# Altium project Summits7Beta.PrjPcb
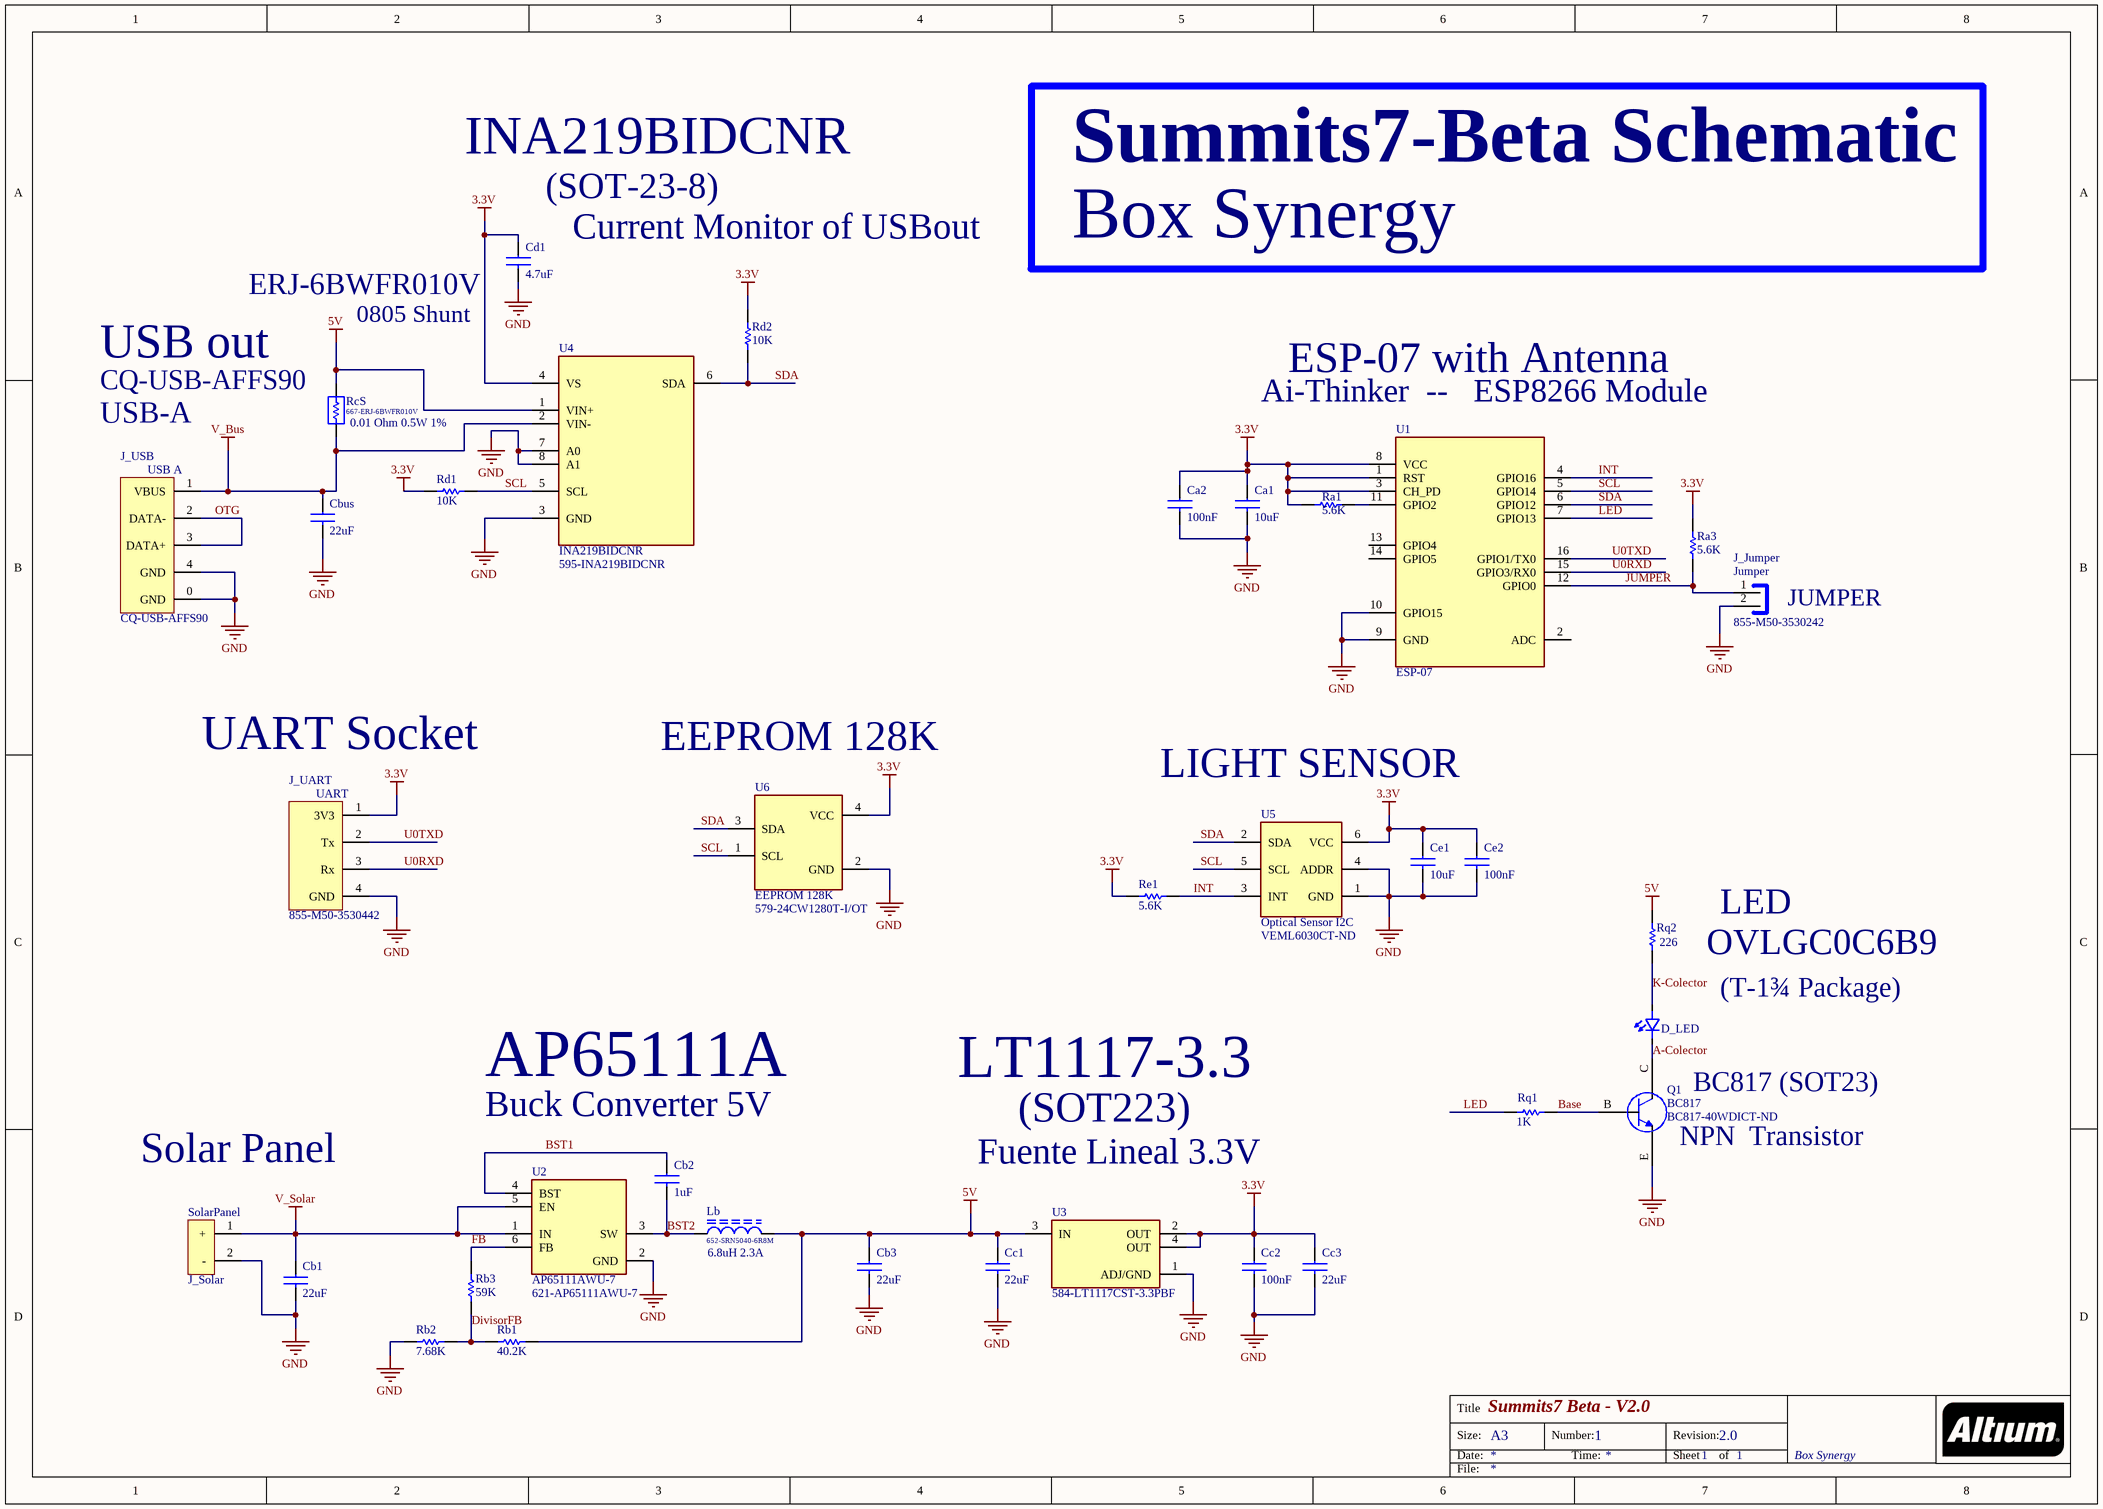
[diagram p0: Summits7Beta_Sch.SchDoc]
1 sheet, 36 parts. Net scope: global (net labels, ports and power ports of the same name join across sheets).
Board file: Summits7Beta_PCB2.PcbDoc

## Sheet Summits7Beta_Sch.SchDoc: Summits7 Beta - V2.0
size A3; Author: Gustavo Belbruno; CompanyName: Box Synergy; DrawnBy: Gustavo Belbruno; Engineer: Gustavo Belbruno; Address4: Box Synergy; DocumentNumber: 1; Revision: 2.0; SheetNumber: 1; SheetTotal: 1

### Parts
Ca1  10uF  [CAP_0603]
Ca2  100nF  [CAP_0603]
Cb1  22uF  [CAP_1210]
Cb2  1uF  [CAP_0603]
Cb3  22uF  [CAP_1210]
Cbus  22uF  [CAP_1210]
Cc1  22uF  [CAP_0603]
Cc2  100nF  [CAP_0603]
Cc3  22uF  [CAP_1210]
Cd1  4.7uF  [CAP_0603]
Ce1  10uF  [CAP_0603]
Ce2  100nF  [CAP_0603]
D_LED  OVLGC0C6B9  [LED]  (value not drawn)
J_Jumper  Supplier Part Number 1: 855-M50-3530242  [JUMPER-1.27 mm]  (hidden comment: M50-3530242)
J_Solar  Connx2_Panel  [PANEL_IN]  (value not drawn)
J_UART  Supplier Part Number 1: 855-M50-3530442  [UART-1.27mm]  (hidden comment: M50-3530442)
J_USB  CQ-USB-AFFS90  [USB-A__IPX8]
Lb  6.8uH 2.3A  Supplier Part Number 1: 652-SRN5040-6R8M  [Inductor_SRN5040]
Q1  BC817  Supplier Part Number 1: BC817-40WDICT-ND  [Transistor_SOT23-3]
Ra1  5.6K  [RES_0603]
Ra3  5.6K  [RES_0603]
Rb1  40.2K  [RES_0603]
Rb2  7.68K  [RES_0603]
Rb3  59K  [RES_0603]
RcS  0.01 Ohm 0.5W 1%  Supplier Part Number 1: 667-ERJ-6BWFR010V  [RES-SHUNT-0805]
Rd1  10K  [RES_0603]
Rd2  10K  [RES_0603]
Re1  5.6K  [RES_0603]
Rq1  1K  [RES_0603]
Rq2  226  [RES_0603]
U1  ESP-07  [ESP-07]
U2  AP65111AWU-7  Supplier Part Number 1: 621-AP65111AWU-7  [AP65111A-SOT23-6]
U3  Supplier Part Number 1: 584-LT1117CST-3.3PBF  [LT1117IST-3.3_SOT-223]  (hidden comment: LT1117IST-3.3)
U4  INA219BIDCNR  Supplier Part Number 1: 595-INA219BIDCNR  [INA219B SOT23]
U5  Optical Sensor I2C  Supplier Part Number 1: VEML6030CT-ND  [VEML6030]
U6  EEPROM 128K  Supplier Part Number 1: 579-24CW1280T-I/OT  [24CW128]

### Nets
3.3V: Ca1.1 Ca2.1 Cc2.1 Cc3.1 Cd1.1 Ce1.1 Ce2.1 J_UART.1(3V3) Ra1.2 Ra3.1 Rd1.1 Rd2.1 Re1.1 U1.1(RST) U1.3(CH_PD) U1.8(VCC) U3.2(OUT) U3.4(OUT) U4.4(VS) U5.6(VCC) U6.4(VCC)
5V: Cb3.1 Cc1.1 Lb.1 Rb1.1 RcS.1 Rq2.1 U3.3(IN) U4.1(VIN+)
GND: Ca1.2 Ca2.2 Cb1.2 Cb3.2 Cbus.2 Cc1.2 Cc2.2 Cc3.2 Cd1.2 Ce1.2 Ce2.2 J_Jumper.2 J_Solar.2(-) J_UART.4(GND) J_USB.0(GND) J_USB.4(GND) Q1.E Rb2.2 U1.9(GND) U1.10(GPIO15) U2.2(GND) U3.1(ADJ/GND) U4.3(GND) U4.7(A0) U4.8(A1) U5.1(GND) U5.4(ADDR) U6.2(GND)
V_Bus: Cbus.1 J_USB.1(VBUS) RcS.2 U4.2(VIN-)
V_Solar: Cb1.1 J_Solar.1(+) U2.1(IN) U2.5(EN)
A-Colector: D_LED.1(K) Q1.C
Base: Q1.B Rq1.1
BST1: Cb2.1 U2.4(BST)
BST2: Cb2.2 Lb.2 U2.3(SW)
DivisorFB: Rb1.2 Rb2.1 Rb3.2
FB: Rb3.1 U2.6(FB)
INT: Re1.2 U1.4(GPIO16) U5.3(INT)
JUMPER: J_Jumper.1 Ra3.2 U1.12(GPIO0)
K-Colector: D_LED.2(A) Rq2.2
LED: Rq1.2 U1.7(GPIO13)
OTG: J_USB.2(DATA-) J_USB.3(DATA+)
SCL: Rd1.2 U1.5(GPIO14) U4.5(SCL) U5.5(SCL) U6.1(SCL)
SDA: Rd2.2 U1.6(GPIO12) U4.6(SDA) U5.2(SDA) U6.3(SDA)
U0RXD: J_UART.3(Rx) U1.15(GPIO3/RX0)
U0TXD: J_UART.2(Tx) U1.16(GPIO1/TX0)
NetRa1_1: Ra1.1 U1.11(GPIO2)

Not connected (* = marked no-connect by the designer): U1 2(ADC) 13(GPIO4) 14(GPIO5)

### Notes on the sheet
- INA219BIDCNR
- Summits7-Beta Schematic
- (SOT-23-8)
- Current Monitor of USBout
- ERJ-6BWFR010V
- Box Synergy
- USB out
- 0805 Shunt
- ESP-07 with Antenna
- CQ-USB-AFFS90
- USB-A
- Ai-Thinker  --   ESP8266 Module
- (near J_Jumper) JUMPER
- UART Socket
- EEPROM 128K
- LIGHT SENSOR
- LED
- OVLGC0C6B9
- (T-1¾ Package)
- Buck Converter 5V
- AP65111A
- LT1117-3.3
- (SOT223)
- BC817 (SOT23)
- Solar Panel
- Fuente Lineal 3.3V
- (near Q1) NPN  Transistor
- Title
- Size:
- Date:
- A3
- Number:
- Time:
- Revision:
- Sheet
- of
- File:
- (in symbol Connx2_Panel) SolarPanel
- (in symbol Connx4_UART) UART
- (in symbol USB-A 5V) USB A

### Library data of the parts
Ca1 Ca2 Cb2 Cc1 Cc2 Cd1 Ce1 Ce2 = Cap_0603_Ceramic: Capac Ceramic SMD
Cb1 Cb3 Cbus Cc3 = Cap_1210_Ceramic: Capac Ceramic SMD
D_LED = OVLGC0C6B9: LED Green-Blue 505nm; MF: Broadcom Limited; MP: HSMW-C191; SnapEDA_Link: https://www.snapeda.com/parts/HSMW-C191/Broadcom%20Limited/view-part/1840124/?ref=snap; Price: None; Value: *; Package: 0603 Broadcom; Availability: Unavailable; Supplier 1: Mouser; Supplier Part Number 1: 828-OVLGC0C6B9
J_Jumper = Jumper: 1.27mm Pin Header 2x1; Supplier 1: Mouser
J_Solar = Connx2_Panel: Conector del Panel
J_UART = Connx4_UART: 1.27mm Pin Header 4x1; Supplier 1: Mouser
J_USB = USB-A 5V: Conector del USB   --   CQ-USB-AFFS90
Lb = Ind_SRN5040: Inductor_SRN5040; MF: Vishay Dale; Availability: Unavailable; Package: Nonstandard Vishay Dale; Value: *; Price: None; SnapEDA_Link: https://www.snapeda.com/parts/IHLP-2525CZ-01/Vishay%20Dale/view-part/561997/?ref=snap; Supplier 1: Mouser
Q1 = BC817: Transistor NPN. Leave 2.5mm height from PCB; Supplier 1: Digi-Key
Ra1 Ra3 Rb1-Rb3 Rd1 Rd2 Re1 Rq1 Rq2 = Res_0603: Resistor SMD; Published: 8-Jun-2000; LatestRevisionDate: 17-Jul-2002; LatestRevisionNote: Re-released for DXP Platform.; PackageReference: AXIAL-0.3; Publisher: Altium Limited; PackageDescription: Axial Device, Thru-Hole; 2 Leads; 0.3 in Pin Spacing
RcS = Shunt_0805: Shunt; Published: 8-Jun-2000; LatestRevisionDate: 17-Jul-2002; LatestRevisionNote: Re-released for DXP Platform.; PackageReference: AXIAL-0.3; Publisher: Altium Limited; PackageDescription: Axial Device, Thru-Hole; 2 Leads; 0.3 in Pin Spacing; Supplier 1: Mouser
U1 = ESP-07: ESP07 Module with Antenna Ai-Thinker; MP: AP65111AWU-7; MF: Diodes Inc.; Availability: Unavailable; SnapEDA_Link: https://www.snapeda.com/parts/AP65111AWU-7/Diodes%20Inc./view-part/1631258/?ref=snap; Price: None; Value: *; Package: TSOT-23-6 Diodes Inc.
U2 = AP65111AWU-7: Buck Switching Regulator IC Positive Adjustable 0.8V 1 Output 1.5A SOT-23-6 Thin, TSOT-23-6; MF: Diodes Inc.; Availability: Unavailable; SnapEDA_Link: https://www.snapeda.com/parts/AP65111AWU-7/Diodes%20Inc./view-part/1631258/?ref=snap; MP: AP65111AWU-7; Price: None; Value: *; Package: TSOT-23-6 Diodes Inc.; Supplier 1: Mouser
U3 = LT1117IST-3.3: LDO Regulator Pos 3.3V 0.8A Automotive 4-Pin_3+Tab_ SOT-223 Tube; MP: LT1117IST-5#PBF; MF: Analog Devices; Value: *; Availability: Unavailable; Price: None; Package: SOT-223-3 Analog Devices; SnapEDA_Link: https://www.snapeda.com/parts/LT1117IST-5%23PBF/Analog%20Devices/view-part/4348177/?ref=snap; Supplier 1: Mouser
U4 = INA219BIDCNR: Current Monitor Regulator High-Side 10mA SOT-23-8; MF: Texas Instruments; SnapEDA_Link: https://www.snapeda.com/parts/INA219BIDCNR/Texas%20Instruments/view-part/870494/?ref=snap; MP: INA219BIDCNR; Value: *; Digi-Key_Part_Number: 296-46420-1-ND; Digi-Key_Purchase_URL: https://www.digikey.com.au/product-detail/en/texas-instruments/INA219BIDCNR/296-46420-1-ND/7033594?utm_source=snapeda&utm_medium=aggregator&utm_campaign=symbol; Package: SOT-23 Texas Instruments; Supplier 1: Mouser
U5 = VEML6030: Optical Ambiental Light Sensor I2C with Interrupt; Supplier 1: Digi-Key
U6 = 24CW1280T-I/OT: Supplier 1: Mouser